# EAGLE design DoorModule_V2.0 (EAGLE 7.6.0)
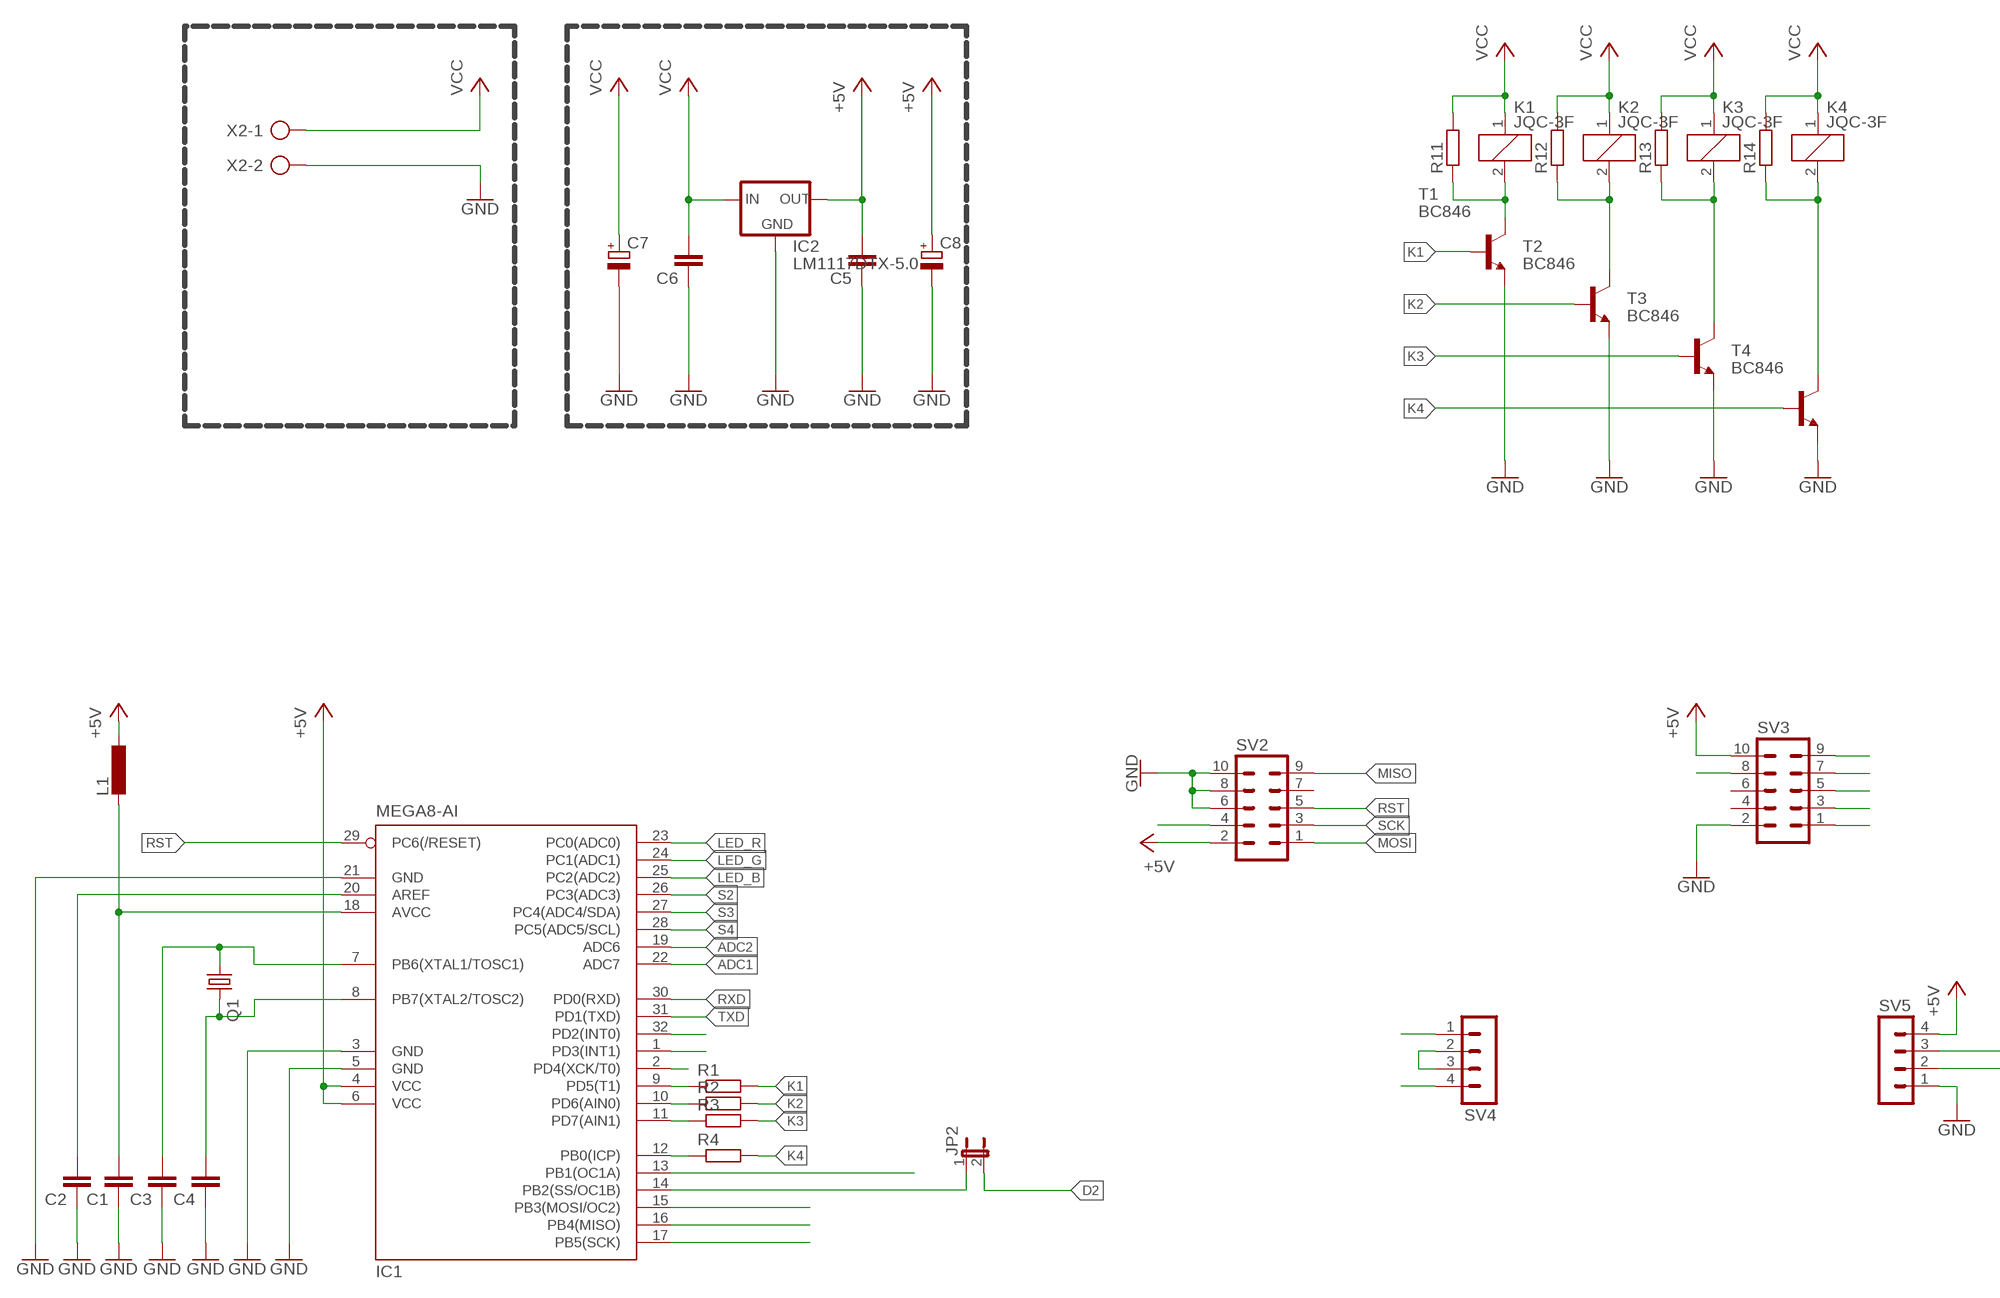
[diagram p0: schematic, sheet 1, part 1 of 2]
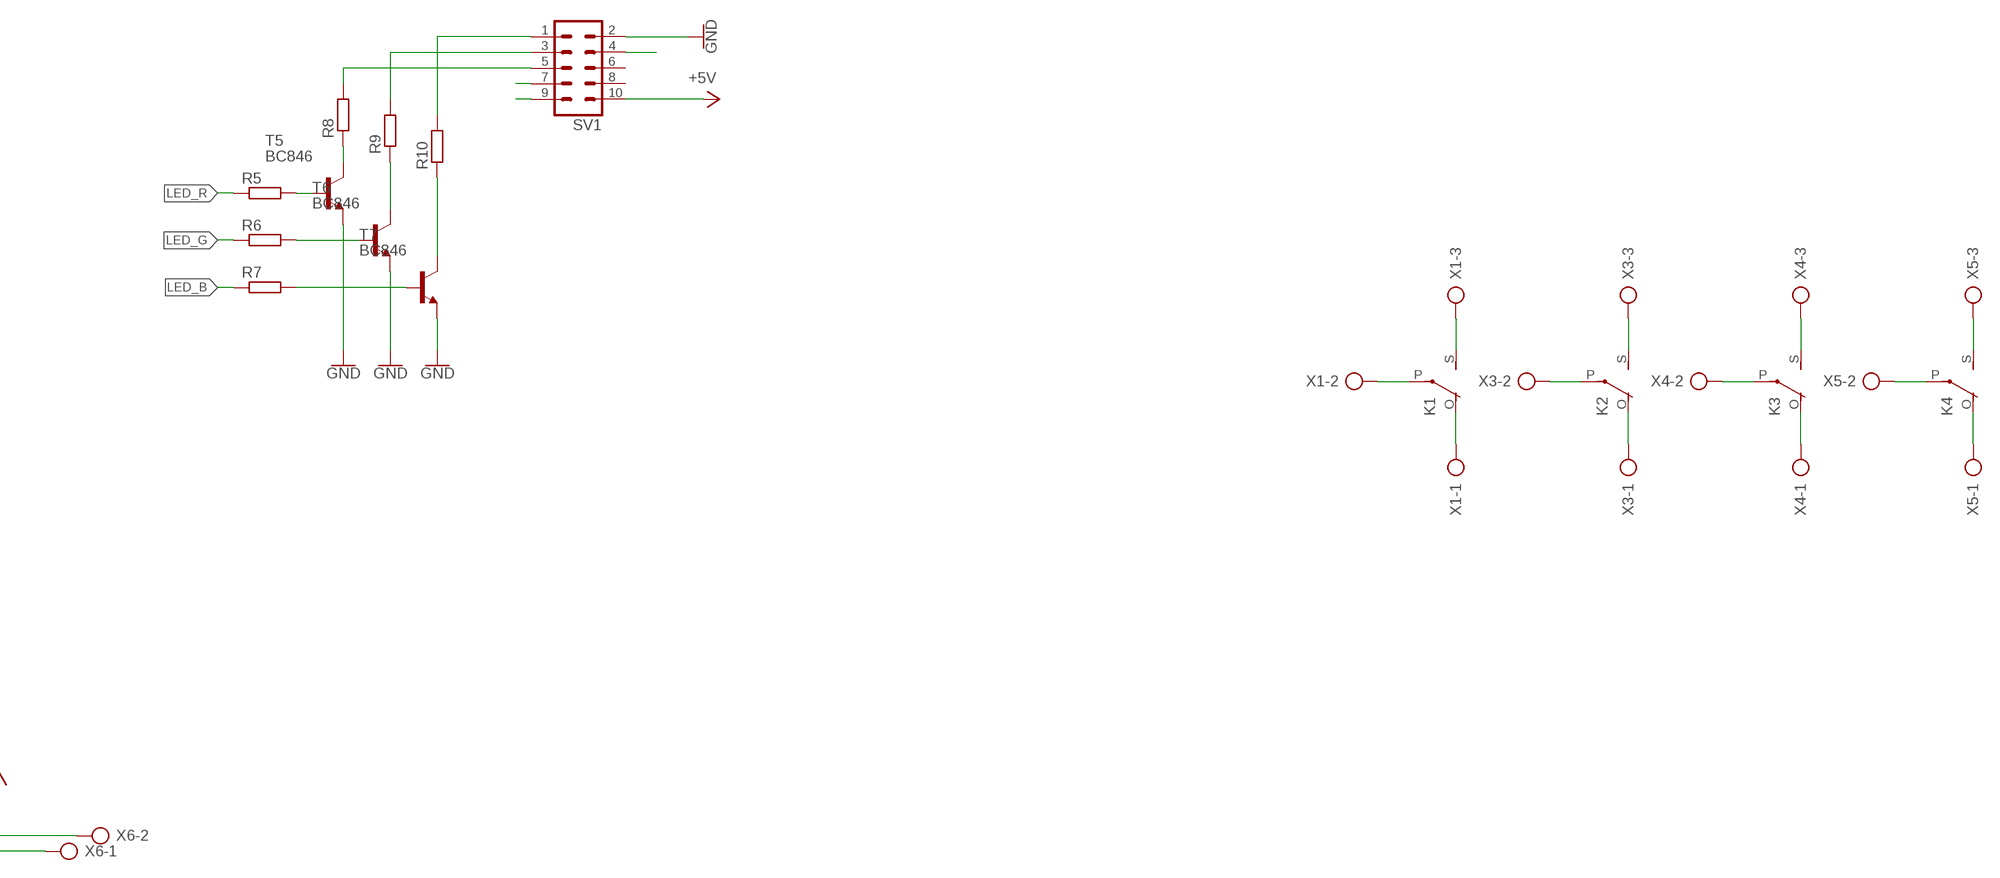
[diagram p1: schematic, sheet 1, part 2 of 2]

## Parts
C1  C-EUC0805  [C0805]
C2  C-EUC0805  [C0805]
C3  C-EUC0805  [C0805]
C4  C-EUC0805  [C0805]
C5  C-EUC0805  [C0805]
C6  C-EUC0805  [C0805]
C7  CPOL-EUE2.5-7  [E2,5-7]
C8  CPOL-EUE2.5-7  [E2,5-7]
IC1  MEGA8-AI  [TQFP32-08]
IC2  LM1117DTX-5.0  [TO252]
JP2  JP1E  [JP1]
K1  JQC-3F  G5LE  [G5LE]
K2  JQC-3F  G5LE  [G5LE]
K3  JQC-3F  G5LE  [G5LE]
K4  JQC-3F  G5LE  [G5LE]
L1  L-EU0204/7  [0204/7]
Q1  CRYSTALHC49U-V  [HC49U-V]
R1  R-EU_R0805  [R0805]
R2  R-EU_R0805  [R0805]
R3  R-EU_R0805  [R0805]
R4  R-EU_R0805  [R0805]
R5  R-EU_R0805  [R0805]
R6  R-EU_R0805  [R0805]
R7  R-EU_R0805  [R0805]
R8  R-EU_0204/7  [0204/7]
R9  R-EU_0204/7  [0204/7]
R10  R-EU_R0805  [R0805]
R11  R-EU_R0805  [R0805]
R12  R-EU_R0805  [R0805]
R13  R-EU_R0805  [R0805]
R14  R-EU_R0805  [R0805]
SV1  ML10L  [ML10L]
SV2  ML10L  [ML10L]
SV3  ML10L  [ML10L]
SV4  MA04-1  [MA04-1]
SV5  MA04-1  [MA04-1]
T1  BC846  [SOT23]
T2  BC846  [SOT23]
T3  BC846  [SOT23]
T4  BC846  [SOT23]
T5  BC846  [SOT23]
T6  BC846  [SOT23]
T7  BC846  [SOT23]
X1  AK300/3  [AK300/3]
X2  AK300/2  [AK300/2]
X3  AK300/3  [AK300/3]
X4  AK300/3  [AK300/3]
X5  AK300/3  [AK300/3]
X6  AK300/2  [AK300/2]

## Nets
+5V: C5.2 C8.+ IC1.4(VCC) IC1.6(VCC) IC2.TAB(OUT) L1.1 SV1.10 SV2.2 SV3.10 SV5.4
ADC1: IC1.22(ADC7) SV3.1
ADC2: IC1.19(ADC6) SV3.3
D1: IC1.13(PB1(OC1A)) SV1.4
D2: JP2.2 SV2.4
GND: C1.1 C2.1 C3.1 C4.1 C5.1 C6.1 C7.- C8.- IC1.3(GND) IC1.5(GND) IC1.21(GND) IC2.1(GND) SV1.2 SV2.6 SV2.8 SV2.10 SV3.2 SV5.1 T1.2(E) T2.2(E) T3.2(E) T4.2(E) T5.2(E) T6.2(E) T7.2(E) X2.2
INT0: IC1.32(PD2(INT0)) SV3.9
INT1: IC1.1(PD3(INT1)) SV3.8
K1: R1.2 T1.1(B)
K2: R2.2 T2.1(B)
K3: R3.2 T3.1(B)
K4: R4.2 T4.1(B)
LED_B: IC1.25(PC2(ADC2)) R7.1
LED_G: IC1.24(PC1(ADC1)) R6.1
LED_R: IC1.23(PC0(ADC0)) R5.1
MISO: IC1.16(PB4(MISO)) SV2.9
MOSI: IC1.15(PB3(MOSI/OC2)) SV2.1
N$1: K1.S(2:S) X1.3
N$2: K1.O(2:O) X1.1
N$3: K1.P(2:P) X1.2
N$4: K2.S(2:S) X3.3
N$5: C1.2 IC1.18(AVCC) L1.2
N$6: C2.2 IC1.20(AREF)
N$7: C3.2 IC1.7(PB6(XTAL1/TOSC1)) Q1.1
N$8: C4.2 IC1.8(PB7(XTAL2/TOSC2)) Q1.2
N$10: R8.2 SV1.5
N$11: K1.2 R11.1 T1.3(C)
N$12: K2.2 R12.1 T2.3(C)
N$13: R5.2 T5.1(B)
N$14: R6.2 T6.1(B)
N$15: R7.2 T7.1(B)
N$16: R8.1 T5.3(C)
N$17: R9.1 T6.3(C)
N$18: R10.1 T7.3(C)
N$19: R9.2 SV1.3
N$20: R10.2 SV1.1
N$21: K3.2 R13.1 T3.3(C)
N$22: K4.2 R14.1 T4.3(C)
N$23: IC1.9(PD5(T1)) R1.1
N$24: IC1.10(PD6(AIN0)) R2.1
N$25: IC1.11(PD7(AIN1)) R3.1
N$26: IC1.12(PB0(ICP)) R4.1
N$31: K2.P(2:P) X3.2
N$32: K2.O(2:O) X3.1
N$33: K3.P(2:P) X4.2
N$34: K3.S(2:S) X4.3
N$35: K3.O(2:O) X4.1
N$36: K4.S(2:S) X5.3
N$37: K4.P(2:P) X5.2
N$38: K4.O(2:O) X5.1
N$39: SV1.9
N$42: SV5.3 X6.2
N$44: SV5.2 X6.1
RS: IC1.2(PD4(XCK/T0)) SV4.2 SV4.3
RST: IC1.29(PC6(/RESET)) SV2.5
RXD: IC1.30(PD0(RXD)) SV4.1
S2: IC1.26(PC3(ADC3)) SV1.7
S3: IC1.27(PC4(ADC4/SDA)) SV3.5
S4: IC1.28(PC5(ADC5/SCL)) SV3.7
SCK: IC1.17(PB5(SCK)) SV2.3
SS: IC1.14(PB2(SS/OC1B)) JP2.1
TXD: IC1.31(PD1(TXD)) SV4.4
VCC: C6.2 C7.+ IC2.2(IN) K1.1 K2.1 K3.1 K4.1 R11.2 R12.2 R13.2 R14.2 X2.1
Unconnected: SV1.6 SV1.8 SV2.7 SV3.4 SV3.6

## Library data of the parts
C1-C6 = rcl:C-EU: CAPACITOR, European symbol
C7 C8 = rcl:CPOL-EU: POLARIZED CAPACITOR, European symbol
IC1 = atmel:MEGA8: MICROCONTROLLER 8 Kbytes FLASH, 1 kbytes SRAM, 512 bytes EEPROM, USART, 6-channel 10 bit ADC, 2-channel 8 bit ADC Pin compatible with Atmega48, ATMega88, ATMega168 Source: avr.lbr; MPN: ATMEGA8-16AU; OC_FARNELL: 9171371; OC_NEWARK: 73M8863
IC2 = lm1117:LM1117DTX-*
JP2 = jumper:JP1E: JUMPER
K1-K4 = relay:G5LE: RELAY 1 x switch, 10 A/120 V AC, 8 A/30 V DC, Omron; OC_FARNELL: unknown; OC_NEWARK: unknown
L1 = rcl:L-EU: INDUCTOR, European symbol
Q1 = crystal:CRYSTAL: CRYSTAL; OC_FARNELL: 1666969; OC_NEWARK: unknown
R1-R14 = rcl:R-EU_: RESISTOR, European symbol
SV1-SV3 = con-harting-ml:ML10: HARTING; OC_FARNELL: unknown; OC_NEWARK: unknown
SV4 SV5 = con-lstb:MA04-1: PIN HEADER; OC_FARNELL: unknown; OC_NEWARK: unknown
T1-T7 = transistor:BC846: NPN TRANSISTOR
X1 X3-X5 = con-ptr500:AK300/3: CONNECTOR; OC_FARNELL: unknown; OC_NEWARK: unknown
X2 X6 = con-ptr500:AK300/2: CONNECTOR; OC_FARNELL: unknown; OC_NEWARK: unknown

## Board
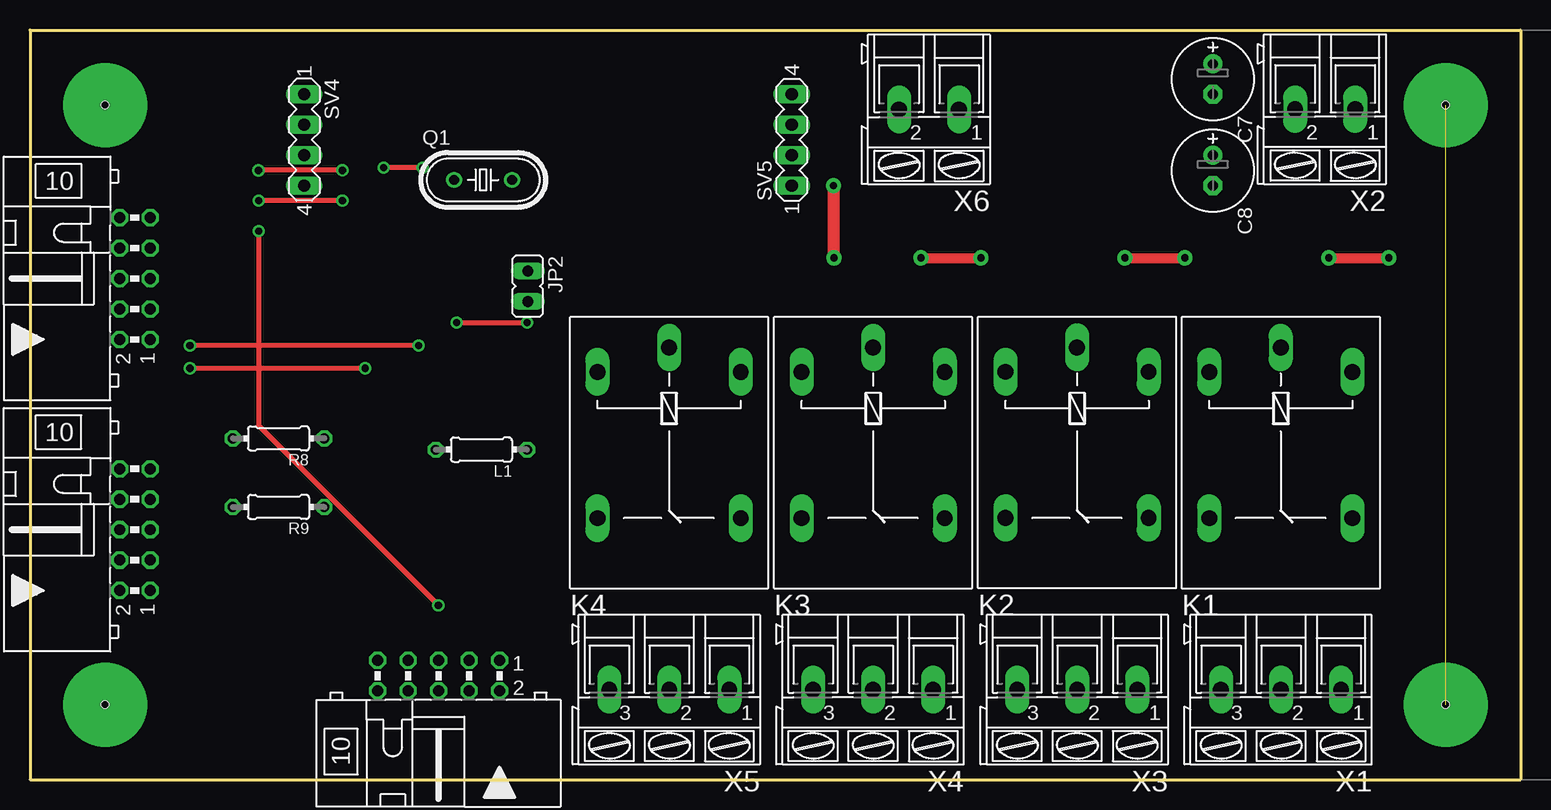
[diagram p2: board, top side]
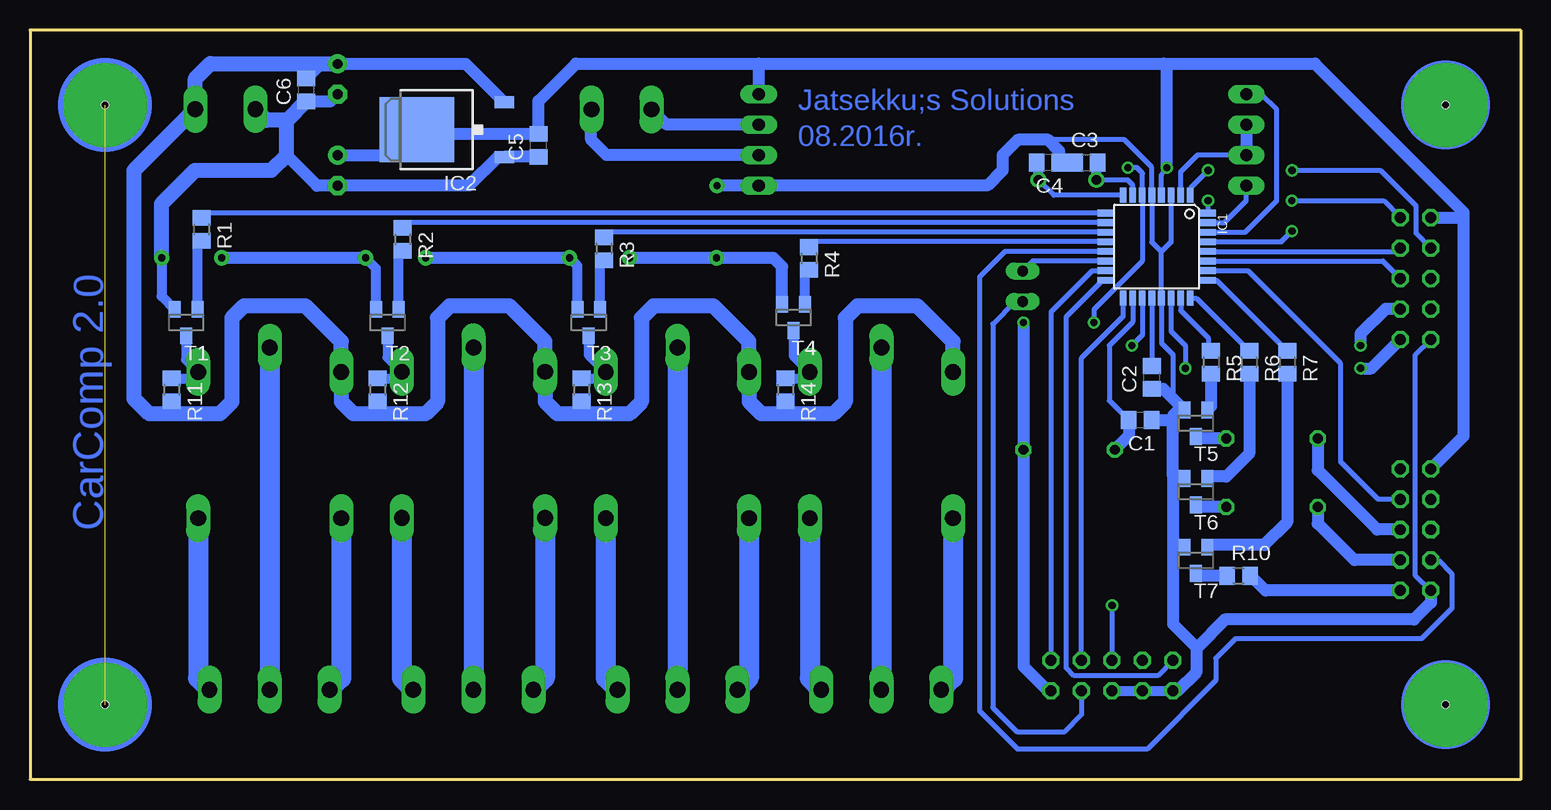
[diagram p3: board, bottom side, seen from below]

Size 124.25 x 62.5 mm. Coordinates in mm from the lower left corner, seen from the top.
Outline: 0,0 124.25,0 124.25,62.5 0,62.5 0,0
Copper layers (1*16): Top 0.035mm / dielectric 1.5mm / Bottom 0.035mm
Design rules "default": minimum track width 10mil, minimum drill 24mil, track to track 8mil, track to pad 8mil, pad to pad 8mil, via to via 8mil, smd to smd 8mil, copper to edge 40mil, drill to drill 8mil, minimum pad ring 10mil, minimum via ring 8mil, stop-mask expansion 4mil, vias tented up to drill 0mil, thermal gap 10mil
Holes 0.6 mm at 118,56.25 118,6.25 6.25,6.25 6.25,56.25

### Footprints (pad centres in the part's own frame; a part is rotated, then mirrored left to right if it is on the bottom)
C0805 = smd 1.3 x 1.5: 1 -0.95,0; 2 0.95,0
E2,5-7 = drill 0.813 pad 1.6: + -1.27,0 | drill 0.813 pad 1.6 octagon: - 1.27,0
TQFP32-08 = smd 1.27 x 0.559: 1 -4.293,2.8; 2 -4.293,2; 3 -4.293,1.2; 4 -4.293,0.4; 5 -4.293,-0.4; 6 -4.293,-1.2; 7 -4.293,-2; 8 -4.293,-2.8; 17 4.293,-2.8; 18 4.293,-2; 19 4.293,-1.2; 20 4.293,-0.4; 21 4.293,0.4; 22 4.293,1.2; 23 4.293,2; 24 4.293,2.8 | smd 0.559 x 1.27: 9 -2.8,-4.293; 10 -2,-4.293; 11 -1.2,-4.293; 12 -0.4,-4.293; 13 0.4,-4.293; 14 1.2,-4.293; 15 2,-4.293; 16 2.8,-4.293; 25 2.8,4.293; 26 2,4.293; 27 1.2,4.293; 28 0.4,4.293; 29 -0.4,4.293; 30 -1.2,4.293; 31 -2,4.293; 32 -2.8,4.293
TO252 = smd 1 x 1.6: 1 -2.28,-4.8; 2 2.28,-4.8 | smd 5.4 x 6.2: TAB 0,2.5
JP1 = drill 0.914 long: 1 0,-1.27; 2 0,1.27
G5LE = drill 1.321 long: 1 -7.493,-5.969; 2 -7.493,5.969; O 4.699,5.969; P -9.525,0; S 4.699,-5.969
0204/7 = drill 0.813 octagon: 1 -3.81,0; 2 3.81,0
HC49U-V = drill 0.813: 1 -2.413,0; 2 2.413,0
R0805 = smd 1.3 x 1.5: 1 -0.95,0; 2 0.95,0
ML10L = drill 0.914 octagon: 1 -5.08,-1.27; 2 -5.08,1.27; 3 -2.54,-1.27; 4 -2.54,1.27; 5 0,-1.27; 6 0,1.27; 7 2.54,-1.27; 8 2.54,1.27; 9 5.08,-1.27; 10 5.08,1.27
MA04-1 = drill 1.016 long: 1 -3.81,0; 2 -1.27,0; 3 1.27,0; 4 3.81,0
SOT23 = smd 1 x 1.4: 1 -0.95,-1.1; 2 0.95,-1.1; 3 0,1.1
AK300/3 = drill 1.321 long: 1 -5.004,0; 2 0,0; 3 5.004,0
AK300/2 = drill 1.321 long: 1 -2.515,0; 2 2.489,0

### Placement (x,y rotation side)
C1  31.7,29.96 180 bottom
C2  30.73,33.53 90 bottom
C3  36.2,51.44 0 bottom
C4  39.4,51.44 180 bottom
C5  81.86,52.88 90 bottom
C6  101.22,57.5 90 bottom
C7  98.6,58.41 270 top
C8  98.6,50.79 270 top
IC1  30.33,44.44 270 bottom
IC2  89.52,54.19 90 bottom
JP2  41.5,41.13 180 top
K1  104.27,26.5 270 top
K2  87.28,26.51 270 top
K3  70.28,26.5 270 top
K4  53.28,26.5 270 top
L1  37.63,27.5 180 top
Q1  37.77,49.99 0 top
R1  109.95,45.88 270 bottom
R2  93.18,45.05 270 bottom
R3  76.41,44.25 270 bottom
R4  59.3,43.45 270 bottom
R5  25.8,34.79 270 bottom
R6  22.62,34.79 270 bottom
R7  19.45,34.79 270 bottom
R8  20.71,28.44 180 top
R9  20.71,22.73 180 top
R10  23.5,17 0 bottom
R11  112.43,32.5 270 bottom
R12  95.28,32.5 270 bottom
R13  78.28,32.5 270 bottom
R14  61.28,32.5 270 bottom
SV1  8.73,20.83 90 top
SV2  34.05,8.66 180 top
SV3  8.74,41.78 90 top
SV4  22.86,53.34 270 top
SV5  63.5,53.34 90 top
T1  111.23,38.11 180 bottom
T2  94.45,38.11 180 bottom
T3  77.67,38.11 180 bottom
T4  60.59,38.53 180 bottom
T5  27.07,29.71 180 bottom
T6  27.07,24 180 bottom
T7  27.07,18.28 180 bottom
X1  104.28,7.49 180 top
X2  107.95,55.89 180 top
X3  87.3,7.49 180 top
X4  70.28,7.49 180 top
X5  53.29,7.49 180 top
X6  74.93,55.88 180 top

### Tracks (layer width: path | path; a pad name or v marks a point on that pad's centre or on a via)
+5V  (via drill 0.6 pad 0.81, 0.6 pad 1.02)
  Top 0.406: v32.74,51.03 v29.49,51.02 | v35.56,38.1 v41.43,38.1
  Bottom 0.406: 31.51,48.75 31.51,50.56 31.99,51.04 32.73,51.04 v32.74,51.03 | IC1.4 29.93,50.42 v29.49,51.02 | IC1.6 31.53,43.23 35.56,39.2 v35.56,38.1
  Bottom 0.533: 31.51,48.75 IC1.6
  Bottom 1.016: SV2.2 39.39,7.39 41.44,9.44 L1.1 41.44,36.82 v41.43,38.1 | C8.+ 94.15,52.06 IC2.TAB 91.65,53.83 C5.2 81.86,56.58 78.74,59.69 63.5,59.69 | v29.49,51.02 29.49,59.43 29.75,59.69 | 4.76,46.67 4.76,47.31 17.14,59.69 29.75,59.69 | 4.76,46.67 4.76,28.62 SV1.10 | SV3.10 4.95,46.86 4.76,46.67 | 63.5,59.69 29.75,59.69 | SV5.4 63.5,59.69
ADC1  (via drill 0.6 pad 1.02)
  Top 0.406: v27.94,34.29 v13.34,34.29
  Bottom 0.406: IC1.22 29.13,37.38 27.94,36.2 v27.94,34.29
  Bottom 1.016: v13.34,34.29 12.42,34.29 SV3.1
ADC2  (via drill 0.6 pad 1.02)
  Top 0.406: v32.38,36.2 v13.34,36.2
  Bottom 0.406: IC1.19 31.53,37.05 v32.38,36.2
  Bottom 1.016: SV3.3 11.24,39.24 13.34,37.15 v13.34,36.2
D1
  Bottom 0.406: IC1.13 42.96,44.03 45.09,41.91 45.09,5.71 41.91,2.54 31.11,2.54 25.4,8.26 25.4,10.11 23.77,11.75 8.26,11.75 5.71,14.29 5.71,17.14 6.86,18.29 SV1.4
D2
  Bottom 0.406: SV2.4 36.59,5.41 38,4 42,4 44,6 44,38 42.13,39.87 JP2.2
GND  (via drill 0.6 pad 1.27)
  Top 0.813: v74.28,43.5 v79.28,43.5 | v91.28,43.5 v96.28,43.5 | v108.28,43.5 v113.28,43.5
  Top 1.016: v66.98,49.52 66.98,43.5 v67.01,43.5
  Bottom 0.305: 102.87,54.61 102.79,54.61
  Bottom 0.406: 28.34,31.13 T5.2 28.97,31.77 28.97,35.42 29.93,36.38 IC1.21 29.93,44.01 | 29.93,44.01 30.73,44.8 IC1.5 30.73,51.05 33.02,53.34 39.37,53.34 | IC1.3 29.13,44.8 29.93,44.01 | SV1.2 7.52,15.75 8.75,16.98 8.75,35.42 SV3.2
  Bottom 0.61: 28.34,30.98 28.18,30.98 T5.2 | 28.8,25.09 28.97,25.27 | T7.2 28.59,19.38 28.97,19
  Bottom 0.813: v113.28,43.5 113.28,40.31 T1.2 | T2.2 95.4,42.62 v96.28,43.5 | T3.2 78.62,42.84 v79.28,43.5 | C3.1 C4.1 | SV2.6 SV2.8 SV2.10
  Bottom 1.016: 28.97,30 28.97,25.27 28.97,19 28.97,12.97 27,11 | 28.97,30 28.97,30.34 28.34,30.98 | T6.2 28.8,25.09 | C2.1 29.78,32.58 T5.2 | v74.28,43.5 v67.01,43.5 62.28,43.5 61.54,42.76 T4.2 | v79.28,43.5 v91.28,43.5 | v96.28,43.5 v108.28,43.5 | SV2.10 28.61,7.39 27,9 27,11 | C1.1 29.01,29.96 28.97,30 | 102.79,54.98 102.79,54.61 102.79,52.15 | 102.87,52.07 100.32,49.52 C8.- 98.58,49.53 87.63,49.53 85.25,51.91 IC2.1 84.7,51.92 C5.1 | C6.1 99.19,56.55 C7.- | C4.1 38.45,52.41 39.37,53.34 41.91,53.34 43.18,52.07 43.18,50.8 44.45,49.53 SV5.1 v66.98,49.52 | SV1.2 7.46,14.76 8.89,13.34 24.66,13.34 27,11
  Bottom 1.27: v113.28,43.5 113.28,48.01 110.49,50.8 104.14,50.8 102.87,52.07 102.87,54.61 | C6.1 102.79,54.98 104.55,54.98 X2.2
H1  (via drill 0.6 pad 7)
  other vias: 6.25,56.25
INT0  (via drill 0.6 pad 1.02)
  Top 0.406: v26.04,48.26 v19.07,48.26 19.05,48.26
  Bottom 0.406: IC1.32 v26.04,48.26 | SV3.9 11.4,48.26 v19.07,48.26
INT1  (via drill 0.6 pad 1.02)
  Top 0.406: v26.04,50.8 v19.05,50.8
  Bottom 0.406: IC1.1 27.47,48.73 27.47,49.36 v26.04,50.8 | SV3.8 8.7,45.55 8.7,47.8 11.69,50.8 v19.05,50.8
K1
  Bottom 0.813: T1.1 110.28,44.67 R1.2
K2
  Bottom 0.813: T2.1 93.5,44.1 R2.2
K3
  Bottom 0.813: T3.1 76.73,42.88 R3.2
K4
  Bottom 0.813: T4.1 59.63,39.65 59.63,42.3 R4.2
LED_B
  Bottom 0.406: 19.76,35.74 R7.1 25.34,41.63 IC1.25
LED_G
  Bottom 0.406: IC1.24 27.02,40.14 R6.1
LED_R
  Bottom 0.406: 26.11,35.42 R5.1 26.04,35.98 26.04,36.83 28.33,39.12 IC1.23
MISO
  Bottom 0.406: SV2.9 30.24,8.66 37.23,8.66 37.86,9.29 37.86,38.6 34.83,41.63 IC1.16
MOSI
  Bottom 0.406: SV2.1 39.13,39 35.72,42.41 34.65,42.41 IC1.15
N$1
  Bottom 1.676: K1.S 98.3,8.47 X1.3
N$2
  Bottom 1.676: K1.O 110.24,8.44 X1.1
N$3
  Bottom 1.676: K1.P 104.27,7.5 X1.2
N$4
  Bottom 1.676: K2.S 81.32,8.46 X3.3
N$5
  Bottom 0.406: C1.2 32.65,30.1 32.33,30.42 | IC1.18 32.33,38.16 34.29,36.2 34.29,31.6 C1.2 | 33.02,30.33 C1.2
  Bottom 1.016: C1.2 32.65,28.67 L1.2
N$6
  Bottom 0.406: IC1.20 C2.2
N$7
  Bottom 0.406: IC1.7 32.33,49.58 32.75,50 Q1.1
  Bottom 0.813: Q1.1 35.36,51.33 C3.2
N$8
  Bottom 0.406: IC1.8 38.92,48.73 Q1.2
  Bottom 0.813: Q1.2 40.18,51.28 C4.2
N$10
  Bottom 1.016: SV1.5 11.94,20.83 16.91,25.8 R8.2
N$11
  Bottom 0.813: T1.3 111.23,34.98 K1.2 110.78,33.45 R11.1
N$12
  Bottom 0.813: T2.3 94.45,35.2 K2.2 93.8,33.45 R12.1
N$13
  Bottom 1.016: R5.2 25.8,31.13 T5.1
N$14
  Bottom 0.61: 25.95,25.27 T6.1
  Bottom 1.016: R6.2 22.62,27.17 24.52,25.27 25.95,25.27
N$15
  Bottom 1.016: R7.2 19.45,21.45 21.35,19.55 25.95,19.55 T7.1
N$16
  Bottom 0.61: 26.89,28.44 T5.3
  Bottom 1.016: R8.1 26.89,28.44
N$17
  Bottom 0.61: 26.89,22.73 T6.3
  Bottom 1.016: R9.1 26.89,22.73
N$18
  Bottom 0.61: 26.89,17.01 T7.3
  Bottom 1.016: R10.1 26.89,17 T7.3
N$19
  Bottom 1.016: SV1.3 13.85,18.29 16.91,21.35 R9.2
N$20
  Bottom 1.016: SV1.1 21.25,15.75 22.5,17 R10.2
N$21
  Bottom 0.813: T3.3 77.67,35.41 K3.2 76.79,33.45 R13.1
N$22
  Bottom 0.813: T4.3 60.59,35.33 K4.2 59.79,33.45 R14.1
N$23
  Bottom 0.406: IC1.9 109.92,47.23 R1.1
N$24
  Bottom 0.406: IC1.10 93.07,46.44 R2.1
N$25
  Bottom 0.406: IC1.11 76.3,45.63 R3.1
N$26
  Bottom 0.406: IC1.12 59.2,44.84 R4.1
N$27FSD  (via drill 0.6 pad 7)  (1 unrouted)
  other vias: 118,56.25 118,6.25
N$30  (via drill 0.6 pad 7)
  other vias: 6.25,6.25
N$31
  Bottom 1.676: K2.P 87.28,7.5 X3.2
N$32
  Bottom 1.676: K2.O 93.25,8.45 X3.1
N$33
  Bottom 1.676: K3.P X4.2
N$34
  Bottom 1.676: K3.S 64.32,8.45 X4.3
N$35
  Bottom 1.676: K3.O 76.25,8.46 X4.1
N$36
  Bottom 1.676: K4.S 47.31,8.46 X5.3
N$37
  Bottom 1.676: K4.P X5.2
N$38
  Bottom 1.676: K4.O 59.25,8.45 X5.1
N$42
  Bottom 1.016: SV5.3 71.17,54.61 X6.2
N$44
  Bottom 1.016: SV5.2 76.2,52.07 77.47,53.34 77.47,55.85 X6.1
RS
  Bottom 0.406: IC1.2 28.33,50.67 26.93,52.07 SV4.3 | SV4.2
  Bottom 1.016: SV4.2 SV4.3
RST  (via drill 0.6 pad 1.02)
  Top 0.406: v34.05,14.52 19.05,29.52 v19.05,45.72
  Bottom 0.406: v34.05,14.52 SV2.5 | IC1.29 19.93,44.84 v19.05,45.72
RXD
  Bottom 0.406: IC1.30 22.95,45.63 20.32,48.26 20.32,55.88 21.59,57.15 SV4.1
S2
  Bottom 0.406: IC1.26 22.75,42.44 15,34.69 15,26.5 11.87,23.37 SV1.7
S3
  Bottom 0.406: IC1.27 11.46,43.23 SV3.5
S4
  Bottom 0.406: IC1.28 10.3,44.03 SV3.7
SCK
  Bottom 0.406: SV2.3 36.59,35.16 33.13,38.62 IC1.17
SS
  Bottom 0.406: IC1.14 40.67,43.23 JP2.1
TXD
  Bottom 0.406: IC1.31 24.68,46.44 22.86,48.26 SV4.4
VCC
  Bottom 0.406: 101.42,39.5 101.28,39.5
  Bottom 0.813: 64.28,33.95 K3.1 | 81.28,33.96 K2.1 | 98.28,33.97 K1.1 | R14.2 61.28,30.5 | R13.2 78.28,30.5 | R12.2 95.28,30.5 | R11.2 112.43,30.5 112.42,30.5
  Bottom 1.016: R11.2 112.43,31.15 111.76,30.48 | 101.19,58.42 C6.2 99.99,59.68 C7.+ 87.92,59.68 IC2.2
  Bottom 1.27: K4.1 47.31,36.53 50.28,39.5 55.28,39.5 56.28,38.5 56.28,31.5 57.28,30.5 61.28,30.5 63.28,30.5 64.28,31.5 64.28,33.95 | K3.1 64.32,36.54 67.28,39.5 72.28,39.5 73.28,38.5 73.28,31.5 74.28,30.5 78.28,30.5 80.28,30.5 81.28,31.5 81.28,33.96 | K2.1 81.32,36.54 84.28,39.5 89.28,39.5 90.28,38.5 90.28,31.5 91.28,30.5 95.28,30.5 97.28,30.5 98.28,31.5 98.28,33.97 | K1.1 98.3,36.52 101.28,39.5 | 101.42,39.5 106.42,39.5 107.42,38.5 107.42,31.5 108.42,30.5 112.42,30.5 | 111.76,30.48 114.3,30.48 115.57,31.75 115.57,50.8 X2.1 110.47,58.44 109.22,59.69 98.62,59.69 C7.+
(copper drawn outside any net)
  shapes: Bottom circle x4

### Text on the board
Bottom: Jatsekku;s Solutions | 08.2016r. | CarComp 2.0